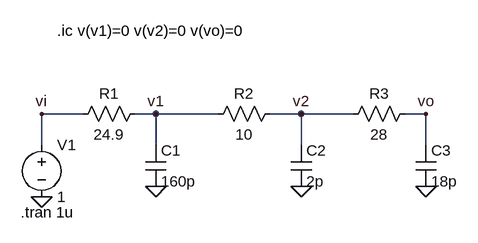
[diagram p0: schematic settling_cap.asc]
settling_cap.asc, the LTspice schematic file:
Version 4.1
SHEET 1 880 680
WIRE 96 32 32 32
WIRE 208 32 176 32
WIRE 304 32 208 32
WIRE 432 32 384 32
WIRE 512 32 432 32
WIRE 624 32 592 32
WIRE 32 80 32 32
WIRE 208 80 208 32
WIRE 432 80 432 32
WIRE 624 80 624 32
FLAG 32 160 0
FLAG 208 144 0
FLAG 432 144 0
FLAG 624 144 0
FLAG 208 32 v1
FLAG 432 32 v2
FLAG 624 32 vo
FLAG 32 32 vi
SYMBOL voltage 32 64 R0
WINDOW 123 0 0 Left 0
WINDOW 39 0 0 Left 0
SYMATTR InstName V1
SYMATTR Value 1
SYMBOL res 192 16 R90
WINDOW 0 0 56 VBottom 2
WINDOW 3 32 56 VTop 2
SYMATTR InstName R1
SYMATTR Value 24.9
SYMBOL cap 192 80 R0
SYMATTR InstName C1
SYMATTR Value 160p
SYMBOL res 400 16 R90
WINDOW 0 0 56 VBottom 2
WINDOW 3 32 56 VTop 2
SYMATTR InstName R2
SYMATTR Value 10
SYMBOL cap 416 80 R0
SYMATTR InstName C2
SYMATTR Value 2p
SYMBOL res 608 16 R90
WINDOW 0 0 56 VBottom 2
WINDOW 3 32 56 VTop 2
SYMATTR InstName R3
SYMATTR Value 28
SYMBOL cap 608 80 R0
SYMATTR InstName C3
SYMATTR Value 18p
TEXT 56 -96 Left 2 !.ic v(v1)=0 v(v2)=0 v(vo)=0
TEXT 0 184 Left 2 !.tran 1u

The netlist it stands for:
* settling_cap.asc
V1 vi 0 1
R1 v1 vi 24.9
C1 v1 0 160p
R2 v2 v1 10
C2 v2 0 2p
R3 vo v2 28
C3 vo 0 18p
.ic v(v1)=0 v(v2)=0 v(vo)=0
.tran 1u
.backanno
.end